# Altium project 1MHz Osc.PrjPcb
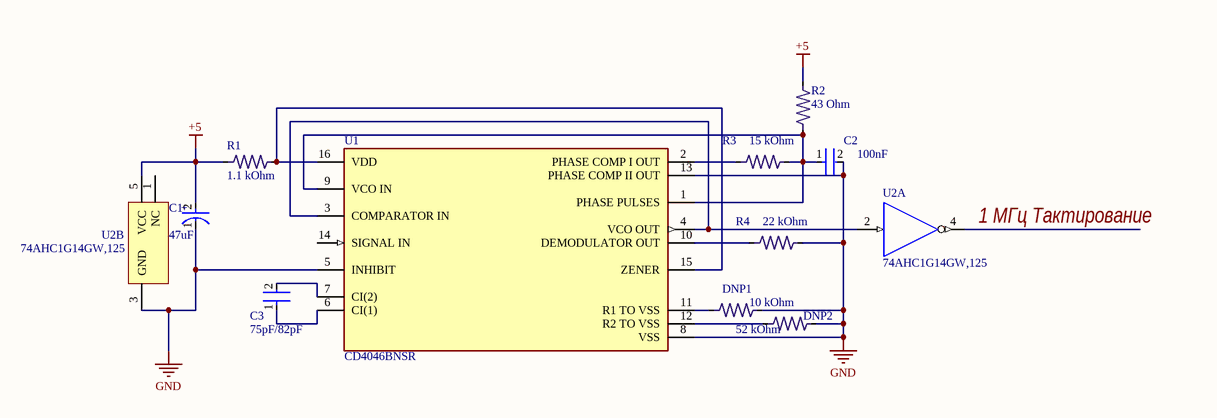
[diagram p0: 1MHz Osc.SchDoc]
1 sheet, 11 parts. Net scope: global (net labels, ports and power ports of the same name join across sheets).

## Sheet 1MHz Osc.SchDoc
size A3

### Parts
C1  value 47uF  [FP-TAJB-MFG]  (hidden comment: TAJB476K010RNJ)
C2  value 100nF  [FP-0805-L_2_01_0_2-W_1_25-IPC_C]  (hidden comment: 08055C104KAT4A)
C3  value 75pF/82pF  [FP-CL21-IPC_C]  (hidden comment: CL21C750JBANNNC)
DNP1  value 10 kOhm  [RES0805]  (hidden comment: DNP)
DNP2  value 52 kOhm  [RES0805]  (hidden comment: DNP)
R1  value 1.1 kOhm  [RES0805]  (hidden comment: kOhm 1%)
R2  value 43 Ohm  [RES0805]  (hidden comment: Ohm 1%)
R3  value 15 kOhm  [RES0805]  (hidden comment: kOhm 1%)
R4  value 22 kOhm  [RES0805]  (hidden comment: kOhm 1%)
U1  CD4046BNSR  [FP-NS0016A-IPC_C]
U2  74AHC1G14GW,125  [NXP-SOT353-1_L]  (parts A,B of 2)

### Nets
+5: C1.2(A) R1.1 R2.2 U2.5(VCC)
GND: C1.1(C) C2.2 DNP1.2 DNP2.2 R4.2 U1.5(INHIBIT) U1.8(VSS) U1.13(PHASE_COMP_II_OUT) U2.3(GND)
1 МГц Тактирование: U2.4(~{Y})
NetC2_1: C2.1 R2.1 R3.2 U1.1(PHASE_PULSES) U1.9(VCO_IN)
NetC3_1: C3.1 U1.6(CI(1))
NetC3_2: C3.2 U1.7(CI(2))
NetDNP1_1: DNP1.1 U1.11(R1_TO_VSS)
NetDNP2_1: DNP2.1 U1.12(R2_TO_VSS)
NetR1_2: R1.2 U1.15(ZENER) U1.16(VDD)
NetR3_1: R3.1 U1.2(PHASE_COMP_I_OUT)
NetR4_1: R4.1 U1.10(DEMODULATOR_OUT)
NetU1_3: U1.3(COMPARATOR_IN) U1.4(VCO_OUT) U2.2(A)

Not connected (* = marked no-connect by the designer): U1 14(SIGNAL_IN); U2 1(NC)

### Notes on the sheet
- (in symbol CMP-04424-000629-1) +

### Library data of the parts
C1 = CMP-04424-000629-1: 47uF 10V  ±10% 1Ω 1210  SMD Tantalum Capacitor; Leakage Current: 4.7uA; ESR (Equivalent Series Resistance): 1R; Dissipation Factor: 8%; Polarity: Polar; Package Quantity: 1; Length: 3.5mm; Dielectric Material: Tantalum; Series: TAJ; Termination: SMD/SMT; Case Code (Metric): 3528; Case Code (Imperial): 1210; Height - Seated (Max): 0.083inch; Lead Pitch: 1.4mm; Features: General Purpose; Radiation Hardening: No; Lead Free: Lead Free; Construction: Flat; RoHS Compliant: Yes; Case/Package: 1210; Min Operating Temperature: -55°C; Voltage: 10V; Depth: 2.8mm; Mount: Surface Mount; REACH SVHC: No SVHC; Width: 0.11inch; Voltage Rating (DC): 10V; Max Operating Temperature: 125°C; Tolerance: 10%; Voltage Rating: 10V; Packaging: Tape and Reel; Number of Pins: 2; Height: 1.9mm
C2 = CMP-1036-04419-3: CAP CER 0.1UF 50V X7R 0805; Dissipation Factor: 2.5%; Dielectric Material: Ceramic; Tolerance: 10%; Package Quantity: 15000; Case/Package: 0805; REACH SVHC: No SVHC; Voltage: 50V; Min Operating Temperature: -55°C; Radiation Hardening: No; Case Code (Imperial): 0805; Construction: Flat; Lead Free: Lead Free; Termination: SMD/SMT; Mount: Surface Mount; Length: 2.01mm; Height: 0.94mm; Packaging: Tape and Reel; Case Code (Metric): 2012; Dielectric: X7R; Number of Pins: 2; Max Operating Temperature: 125°C; Voltage Rating: 50V; Depth: 1.25mm; Width: 1.25mm; Voltage Rating (DC): 50V; RoHS Compliant: Yes
C3 = CMP-13271-004845-1: CL21 Series 0805 75pF 50V ±5% Tolerance C0G Multilayer Ceramic Chip Capacitor; Min Operating Temperature: -55°C; Thickness: 0.03inch; Length: 2mm; Voltage Rating: 50V; Series: CL; Tolerance: 5%; Case Code (Imperial): 0805; Case/Package: 0805; Radiation Hardening: No; Construction: Flat; RoHS Compliant: Yes; Depth: 1.25mm; Packaging: Tape and Reel; Mount: Surface Mount; Voltage Rating (DC): 50V; Package Quantity: 1; Case Code (Metric): 2012; Dielectric: C0G; Height: 0.65mm; Width: 0.049inch; Max Operating Temperature: 125°C
DNP1 DNP2 = DNP: Tolerance: 1%; Type: 0805
U1 = CMP-0776-00058-4: IC PHASE-LOCK LOOP MCPWR 16SO; Nominal Supply Current: 10uA; Max Supply Current: 1uA; Max Supply Voltage: 18V; PLL: Yes; Number of Bits: 1; Min Supply Voltage: 3V; Max Frequency: 2.4MHz; Input: CMOS; Max Operating Temperature: 125°C; Height: 1.85mm; Contact Plating: Gold; Supply Current: 10uA; Packaging: Tape and Reel; Length: 10.5mm; Width: 5.6mm; Package Quantity: 2000; Radiation Hardening: No; Number of Pins: 16; RoHS Compliant: Yes; REACH SVHC: No SVHC; Series: CD4046B; Min Operating Temperature: -55°C; Number of Circuits: 1; Case/Package: SOP; Mount: Surface Mount; Frequency: 2.4MHz; Number of Elements: 1; Weight: 0.007079oz; Lead Free: Lead Free
U2 = CMP-2000-05678-1: Inverting Schmitt Trigger, 1 uA, 2 to 5.5 V, -40 to 125 degC, 5-Pin TSSOP (SOT353-1), RoHS, Reel; Manufacturer: NXP Semiconductors; Other Names: 568-2502-6; Voltage - Supply: 2V~5.5V; Dynamic Catalog: 74AHC; Current - Quiescent (Max): 1µA; Logic Level - Low: 0.9V~1.65V; Number of Inputs: 1; Product Training Modules: LogicPackages; Logic Level - High: 2.2V~3.85V; Max Propagation Delay @ V, Max CL: 10.6ns@4.5V~5.5V,50pF; Current - Output High, Low: 8mA,8mA; Logic Type: Inverter,Buffer; Mounting Type: SurfaceMount; Series: 74AHC; Family: Logic-GatesandInverters; Category: IntegratedCircuits(ICs); Packaging: Digi-Reel®; Number of Circuits: 1; Manufacturer URL: http://www.nxp.com/; Supplier Device Package: 5-TSSOP; Operating Temperature: -40°C~125°C; Features: SchmittTrigger; Package Reference: SOT353-1; Package URL: http://www.nxp.com/documents/outline_drawing/SOT353-1.pdf; Datasheet URL: http://www.nxp.com/documents/data_sheet/74AHC_AHCT1G14.pdf; Mounting Technology: SurfaceMount; Standard Package: 1; Datasheet Version: Rev. 8, 01/2016; Package / Case: 6-TSSOP(5Lead),SC-88A,SOT-353; Package Description: 5-Pin Thin Shrink Small Outline Package, Body 2.05 x 1.25 mm, Pitch 0.65 mm
R1 R3 R4 = kOhm 1%: Type: 0805; Tolerance: 1%
R2 = Ohm 1%: Tolerance: 1%; Type: 0805